# EAGLE design TorquePotSch_SINGLEBOARD (EAGLE 9.2.1)
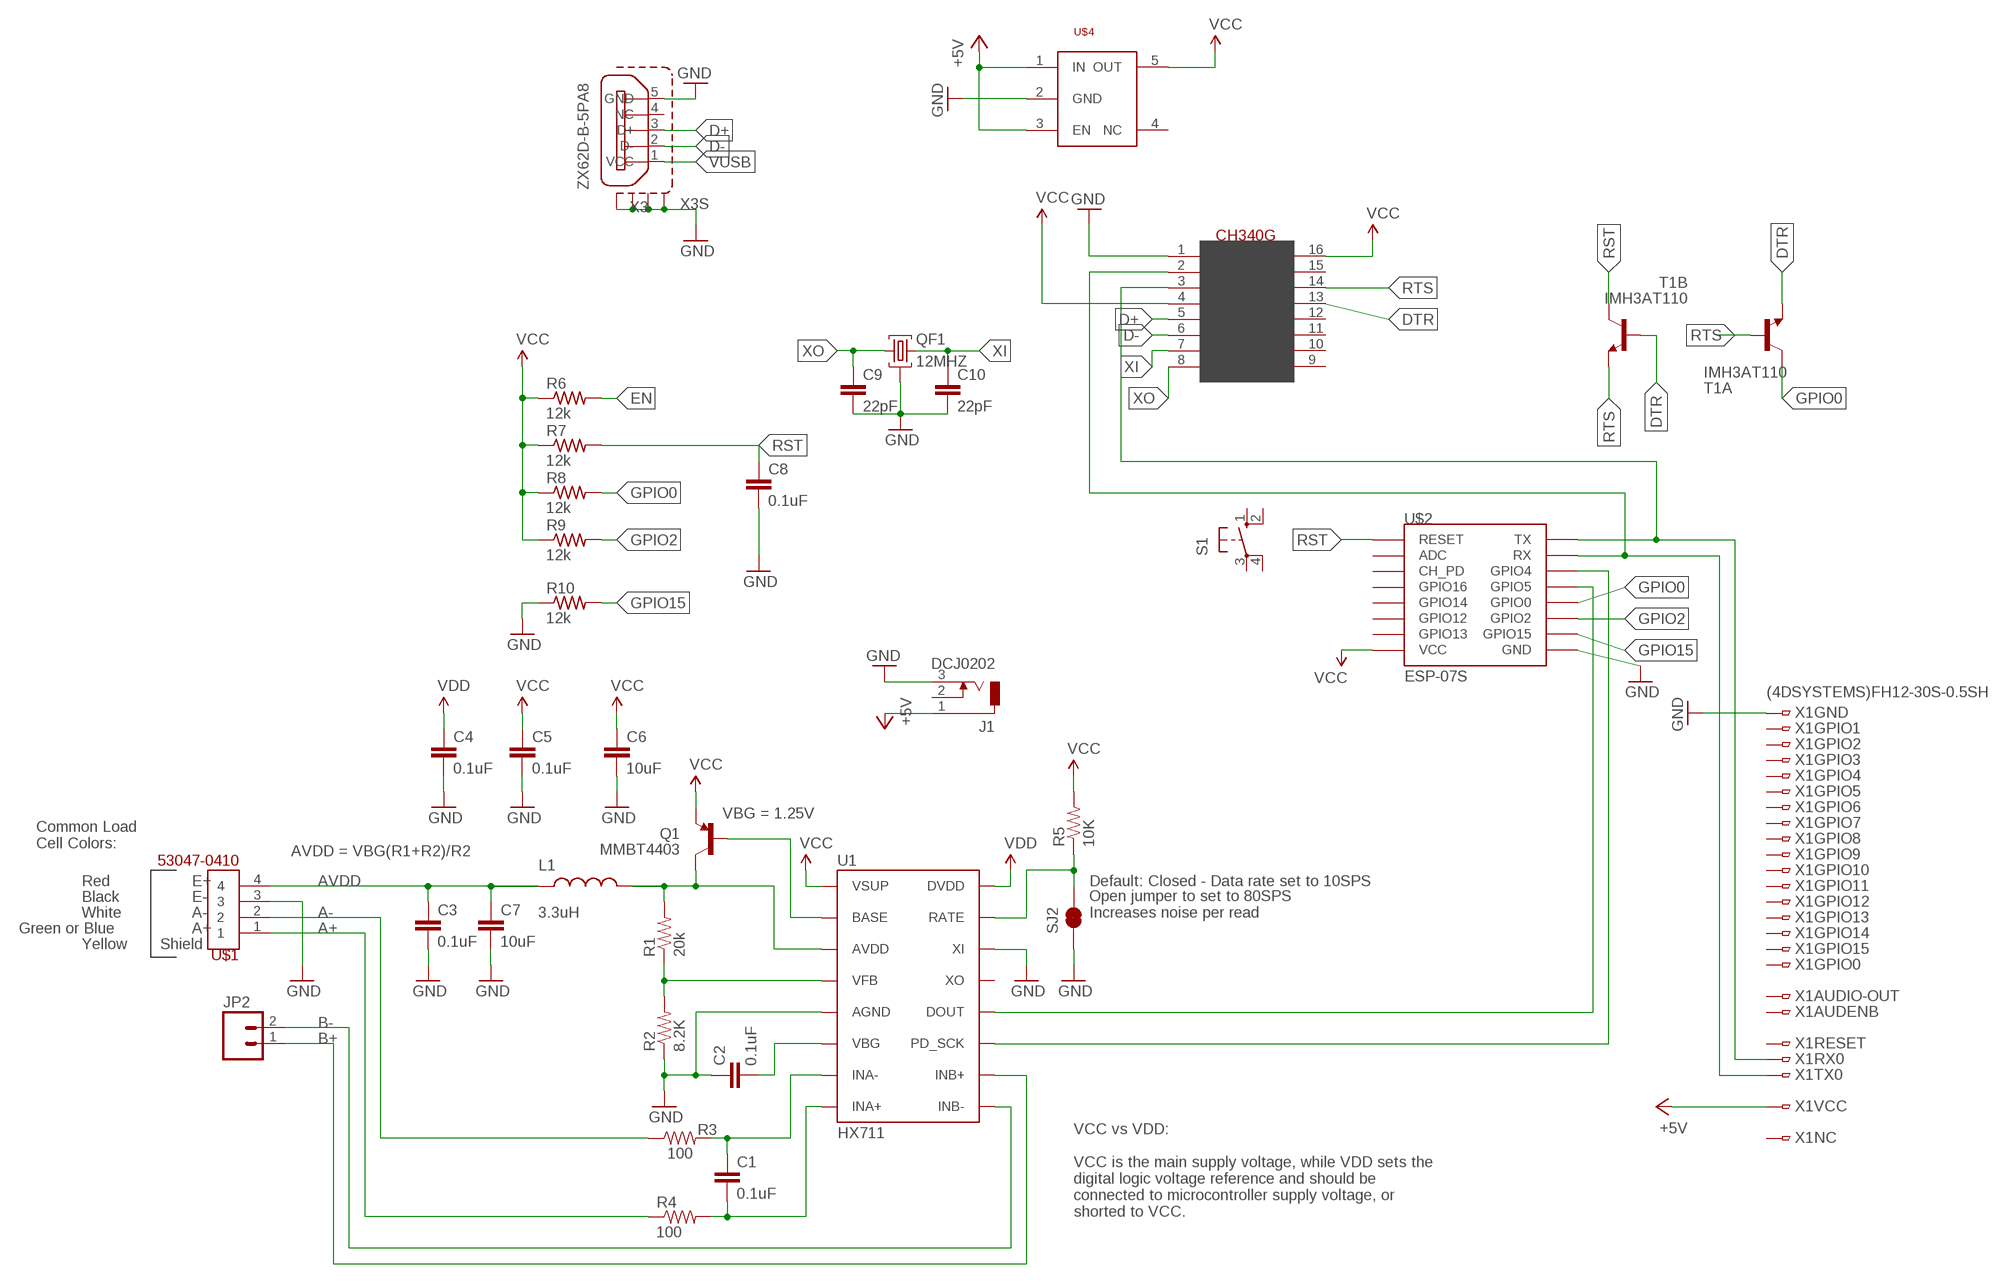
[diagram p0: schematic, sheet 1]

## Parts
C1  0.1uF  0.1UF-25V-5%(0603)  [0603-CAP]
C2  0.1uF  0.1UF-25V-5%(0603)  [0603-CAP]
C3  0.1uF  0.1UF-25V-5%(0603)  [0603-CAP]
C4  0.1uF  0.1UF-25V-5%(0603)  [0603-CAP]
C5  0.1uF  0.1UF-25V-5%(0603)  [0603-CAP]
C6  10uF  10UF50V20%(1210)  [1210]
C7  10uF  10UF50V20%(1210)  [1210]
C8  0.1uF  0.1UF-25V-5%(0603)  [0603-CAP]
C9  22pF  0.1UF-25V-5%(0603)  [0603-CAP]
C10  22pF  0.1UF-25V-5%(0603)  [0603-CAP]
J1  DCJ0202  [DCJ0202]
JP2  M02PTH  [1X02]
L1  3.3uH  INDUCTOR0805-IND  [0805]
Q1  MMBT4403  TRANSISTOR_PNPMMBT4403  [SOT23-3]
QF1  12MHZ  10M7AHC49T  [HC49U]
R1  20k  20KOHM1/10W1%(0603)  [0603-RES]
R2  8.2K  8.2KOHM-1/10W-5%(0603)  [0603-RES]
R3  100  100OHM-1/10W-1%(0603)  [0603-RES]
R4  100  100OHM-1/10W-1%(0603)  [0603-RES]
R5  10K  10KOHM-1/10W-1%(0603)0603  [0603-RES]
R6  12k  R-US_R0805  [R0805]
R7  12k  R-US_R0805  [R0805]
R8  12k  R-US_R0805  [R0805]
R9  12k  R-US_R0805  [R0805]
R10  12k  R-US_R0805  [R0805]
S1  10-XX  [B3F-10XX]
SJ2  JUMPER-PAD-2-NC_BY_TRACE  [PAD-JUMPER-2-NC_BY_TRACE_YES_SILK]
T1  IMH3AT110  [SMT6]
U1  HX711  HX711HX711  [SO16]
U$1  53047-0410  [53047-0410]
U$2  ESP-07S  [ESP07S]
U$3  CH340G  [SOIC16]
U$4  TLV755P  [SOT23-5L]
X1  (4DSYSTEMS)FH12-30S-0.5SH  [FH12-30S-0.5SH]
X3  ZX62D-B-5PA8  [ZX62D-B-5PA8]

## Nets
+5V: J1.1 U$4.1(IN) U$4.3(EN) X1.26 X1.27
A+: R4.1 U$1.1
A-: R3.1 U$1.2
AVDD: C3.1 C7.1 L1.1 U$1.4
B+: JP2.1 U1.10(INB+)
B-: JP2.2 U1.9(INB-)
D+: U$3.5(D+) X3.3(D+)
D-: U$3.6(D-) X3.2(D-)
DTR: T1.6(A:E) U$3.13(DTR)
EN: R6.2
GND: C2.1 C3.2 C4.2 C5.2 C6.2 C7.2 C8.2 C9.2 C10.2 J1.3 QF1.2 R2.1 R10.1 SJ2.1 U1.5(AGND) U1.14(XI) U$1.3 U$2.GND U$3.1(GND) U$4.2(GND) X1.1 X1.21 X1.25 X1.30 X3.5(GND) X3.S1 X3.S2 X3.S3 X3.S4
GPIO0: R8.2 T1.1(A:C) U$2.GPIO0
GPIO2: R9.2 U$2.GPIO2
GPIO15: R10.2 U$2.GPIO15
N$1: R5.1 SJ2.2 U1.15(RATE)
N$2: C1.1 R3.2 U1.7(INA-)
N$3: C1.2 R4.2 U1.8(INA+)
N$4: Q1.1(B) U1.2(BASE)
N$5: L1.2 Q1.3(C) R1.2 U1.3(AVDD)
N$6: R1.1 R2.2 U1.4(VFB)
N$7: C2.2 U1.6(VBG)
N$8: U1.12(DOUT) U$2.GPIO5
N$9: U1.11(PD_SCK) U$2.GPIO4
N$10: U$2.TX U$3.3(RX) X1.23
N$11: U$2.RX U$3.2(TX) X1.24
N$12: T1.4(B:C)
N$13: T1.2(B:B)
N$14: T1.3(B:E)
N$16: T1.5(A:B)
RST: C8.1 R7.2 U$2.REST(RESET)
RTS: U$3.14(RTS)
VCC: C5.1 C6.1 Q1.2(E) R5.2 R6.1 R7.1 R8.1 R9.1 U1.1(VSUP) U$2.VCC U$3.4(V3) U$3.16(VCC) U$4.5(OUT)
VDD: C4.1 U1.16(DVDD)
VUSB: X3.1(VCC)
XI: C10.1 QF1.3 U$3.7(XI)
XO: C9.1 QF1.1 U$3.8(XO)
Unconnected: J1.2 S1.1(S) S1.2(S1) S1.3(P) S1.4(P1) U1.13(XO) U$2.ADC U$2.CH_PD U$2.GPIO12 U$2.GPIO13 U$2.GPIO14 U$2.GPIO16 U$3.9(CTS) U$3.10(DSR) U$3.11(RI) U$3.12(DCD) U$3.15(RS232) U$4.4(NC) X1.2 X1.3 X1.4 X1.5 X1.6 X1.7 X1.8 X1.9 X1.10 X1.11 X1.12 X1.13 X1.14 X1.15 X1.16 X1.17 X1.18 X1.19 X1.20 X1.22 X1.28 X1.29 X3.4(NC)

## Notes on the sheet
- VBG = 1.25V
- Common Load
  Cell Colors:
- AVDD = VBG(R1+R2)/R2
- Red | E+ | Default: Closed - Data rate set to 10SPS
- Black | E-
- White | A-
- Open jumper to set to 80SPS
  Increases noise per read
- Green or Blue | A+
- Yellow | Shield
- VCC vs VDD:
  
  VCC is the main supply voltage, while VDD sets the
  digital logic voltage reference and should be
  connected to microcontroller supply voltage, or
  shorted to VCC.

## Library data of the parts
C1-C5 C8 = SparkFun-Capacitors:0.1UF-25V-5%(0603): CAP-08604; PROD_ID: CAP-08604
C6 C7 = SparkFun-Capacitors:10UF50V20%(1210): CAP-09824; PROD_ID: CAP-09824
C9 C10 = SparkFun-Capacitors:0.1UF-25V-5%(0603): CAP-08604; PROD_ID: CAP-08604; VALUE: 0.1uF
J1 = con-jack:DCJ0202: DC POWER JACK Source: DCJ0202.pdf; OC_FARNELL: unknown; OC_NEWARK: unknown
JP2 = SparkFun-Connectors:M02: Standard 2-pin 0.1" header. Use with - straight break away headers ( PRT-00116) - right angle break away headers (PRT-00553) - swiss pins (PRT-00743) - machine pins (PRT-00117) - female headers (PRT-00115) Molex polarized connector foot print use with: PRT-08233 with associated crimp pins and housings. 2.54_SCREWTERM for use with PRT-10571. 3.5mm Screw Terminal footprints for PRT-08084 5mm Screw Terminal footprints for use with PRT-08432
L1 = SparkFun-Passives:INDUCTOR: Inductors Basic Inductor/Choke - 0603 and 1206. Footprints are not proven and vary greatly between part numbers. INDUCTOR POWER 3.3UH 4.0A SMD 0.197" L x 0.197" W x 0.177" H (5.00mm x 5.00mm x 4.50mm); PROD_ID: NDUC-13076
Q1 = SparkFun-DiscreteSemi:TRANSISTOR_PNP: Generic PNP BJT Double check pinouts against datasheets- not all devices are the same! MMBT3906 - 40V 200mA SOT-23 (TRANS-08052) MMBT4403 - 40V 600mA SOT-23 (TRANS-09245); PROD_ID: TRANS-09245
QF1 = crystal:10M*A: Monolithic Crystal Filters Source: www.vanlong.com; OC_FARNELL: unknown; OC_NEWARK: unknown
R1 = SparkFun-Resistors:20KOHM1/10W1%(0603): RES-09383; PROD_ID: RES-09383
R2 = SparkFun-Resistors:8.2KOHM-1/10W-5%(0603): RES-10646; PROD_ID: RES-10646
R3 R4 = SparkFun-Resistors:100OHM-1/10W-1%(0603): RES-07863; PROD_ID: RES-07863
R5 = SparkFun-Resistors:10KOHM-1/10W-1%(0603): RES-00824; PROD_ID: RES-00824
R6-R10 = adafruit:R-US_: RESISTOR, American symbol
S1 = switch-omron:10-XX: OMRON SWITCH; MPN: B3F-1000; OC_FARNELL: 176432; OC_NEWARK: 36M3542
SJ2 = SparkFun-Passives:JUMPER-PAD-2-NC_BY_TRACE
T1 = personal:IMH3AT110: General purpose transistors (dual digital transistors) Two DTC143T chips in a EMT or UMT or SMT package. http://rohmfs.rohm.com/en/products/databook/datasheet/discrete/transistor/digital/emh3t2r-e.pdf; MPN: IMH3AT110
U1 = Testing:HX711; PROD_ID: IC-12445
U$1 = personal:53047-0410: Molex Picoblade 4 way PCB Header
U$2 = esp8266modules:ESP-07S
U$3 = usb-serial:CH340G
U$4 = personal:TLV755P
X1 = personal:(4DSYSTEMS)FH12-30S-0.5S: 0.5mm Pitch Connectors For FPC/FFC Source: Data sheet <http://www.hirose.co.jp/cataloge_hp/e58605370.pdf> 4d systems data sheet: Data sheet <https://4dsystems.com.au/mwdownloads/download/link/id/70/>; MPN: FH12-30S-0.5SH(55); OC_FARNELL: 1324555; OC_NEWARK: 34M6176
X3 = zx62d-b-5pa8-oshpark_10:ZX62D-B-5PA8: Micro USB Type B Connector - Standard, Shell Through Hole Source: http://www.hirose.co.jp/cataloge_hp/ed_ZX_20140804.pdf; MF: Hirose; MPN: ZX62D-B-5PA8; OC_FARNELL: 2300438; OC_NEWARK: 69W0712

## Board
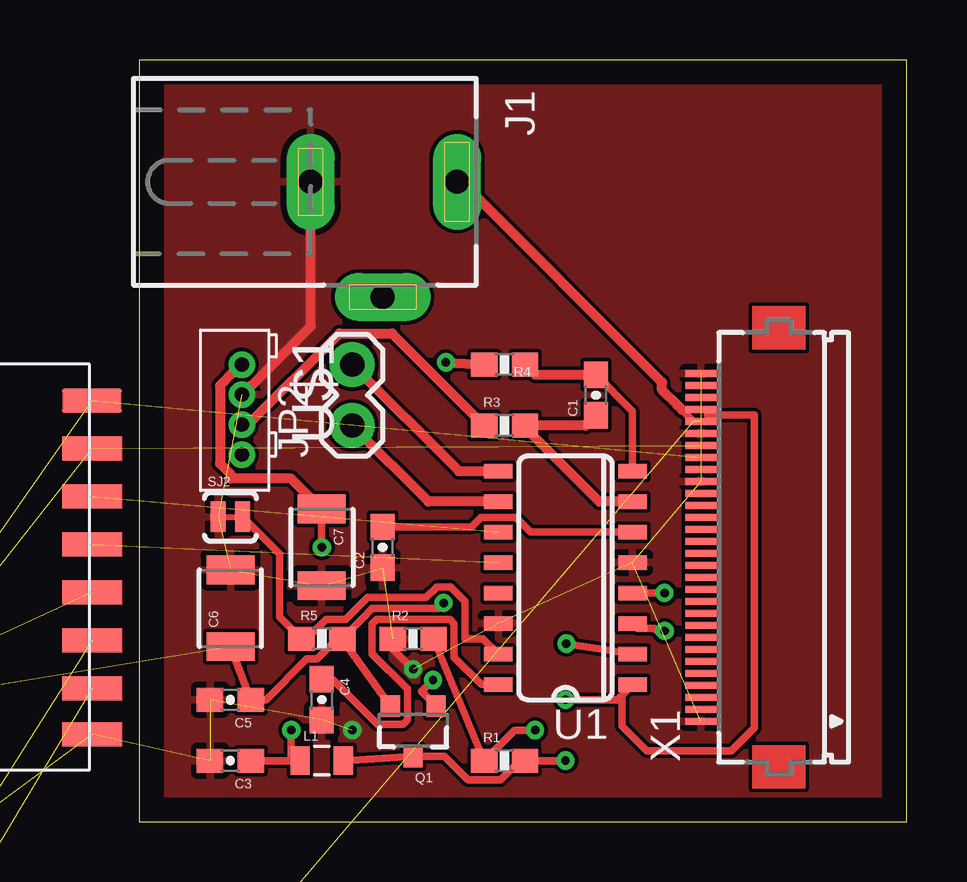
[diagram p1: board, top side]
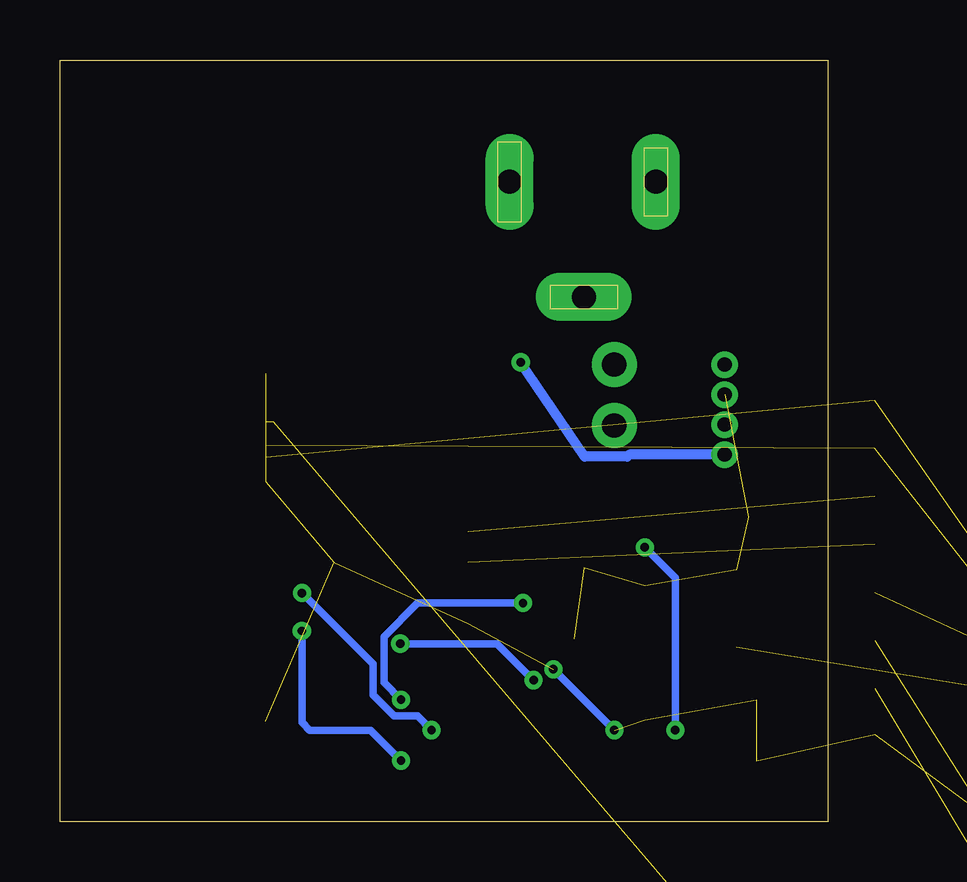
[diagram p2: board, bottom side, seen from below]

Size 32 x 31.75 mm. Coordinates in mm from the lower left corner, seen from the top.
Outline: 0,0 32,0 32,31.75 0,31.75 0,0
Copper layers (1*16): Top 0.035mm / dielectric 1.5mm / Bottom 0.035mm
Design rules "default": minimum track width 6mil, minimum drill 0.35mm, track to track 6mil, track to pad 6mil, pad to pad 6mil, via to via 6mil, smd to smd 6mil, copper to edge 40mil, drill to drill 6mil, minimum pad ring 10mil, minimum via ring 8mil, stop-mask expansion 4mil, vias tented up to drill 0mil, thermal gap 10mil

### Footprints (pad centres in the part's own frame; a part is rotated, then mirrored left to right if it is on the bottom)
0603-CAP = smd 1.1 x 1: 1 -0.85,0; 2 0.85,0
1210 = smd 1.2 x 2: 1 -1.6,0; 2 1.6,0
DCJ0202 = drill 1 pad 2 long: 1 0,3.1; 2 4.8,0; 3 0,-3
1X02 = drill 1.016 pad 1.88: 1 0,0; 2 2.54,0
0805 = smd 0.8 x 1.2: 1 -0.9,0; 2 0.9,0
SOT23-3 = smd 0.8 x 0.9: 1 -0.95,-1; 2 0.95,-1; 3 0,1.1
HC49U = drill 0.7 pad 1.2: 1 -2.413,0; 2 -0.027,0; 3 2.413,0
0603-RES = smd 1.1 x 1: 1 -0.85,0; 2 0.85,0
R0805 = smd 1.1 x 1.4: 1 -1,0; 2 1,0
B3F-10XX = drill 1.016 long: 1 -3.251,2.261; 2 3.251,2.261; 3 -3.251,-2.261; 4 3.251,-2.261
PAD-JUMPER-2-NC_BY_TRACE_YES_SILK = smd 0.635 x 1.27: 1 -0.508,0; 2 0.508,0
SMT6 = smd 0.9 x 0.4: 1 -1.175,0.95; 2 -1.175,0; 3 -1.175,-0.95; 4 1.175,-0.95; 5 1.175,0; 6 1.175,0.95
SO16 = smd 0.6 x 1.2: 1 -4.445,-2.8; 2 -3.175,-2.8; 3 -1.905,-2.8; 4 -0.635,-2.8; 5 0.635,-2.8; 6 1.905,-2.8; 7 3.175,-2.8; 8 4.445,-2.8; 9 4.445,2.8; 10 3.175,2.8; 11 1.905,2.8; 12 0.635,2.8; 13 -0.635,2.8; 14 -1.905,2.8; 15 -3.175,2.8; 16 -4.445,2.8
53047-0410 = drill 0.6 pad 1.016: 1 3.75,0.475; 2 2.5,0.475; 3 1.25,0.475; 4 0,0.475
ESP07S = smd 2.5 x 1: ADC -8.2,3.8; CH_PD -8.2,1.8; GND 8.2,-8.105; GPIO0 8.2,-2.2; GPIO2 8.2,-4.2; GPIO4 8.2,1.8; GPIO5 8.2,-0.2; GPIO12 -8.2,-4.2; GPIO13 -8.2,-6.2; GPIO14 -8.2,-2.2; GPIO15 8.2,-6.2; GPIO16 -8.2,-0.2; REST -8.2,5.8; RX 8.2,3.8; TX 8.2,5.8; VCC -8.2,-8.105
SOIC16 = smd 0.635 x 1.524: 1 -4.445,-2.695; 2 -3.175,-2.695; 3 -1.905,-2.695; 4 -0.635,-2.695; 5 0.635,-2.695; 6 1.905,-2.695; 7 3.175,-2.695; 8 4.445,-2.695; 9 4.445,2.695; 10 3.175,2.695; 11 1.905,2.695; 12 0.635,2.695; 13 -0.635,2.695; 14 -1.905,2.695; 15 -3.175,2.695; 16 -4.445,2.695
SOT23-5L = smd 0.9 x 0.4: 1 -1.175,0.95; 2 -1.175,0; 3 -1.175,-0.95; 4 1.175,-0.95; 5 1.175,0.95
FH12-30S-0.5SH = smd 0.3 x 1.3: 1 -7.25,3.25; 2 -6.75,3.25; 3 -6.25,3.25; 4 -5.75,3.25; 5 -5.25,3.25; 6 -4.75,3.25; 7 -4.25,3.25; 8 -3.75,3.25; 9 -3.25,3.25; 10 -2.75,3.25; 11 -2.25,3.25; 12 -1.75,3.25; 13 -1.25,3.25; 14 -0.75,3.25; 15 -0.25,3.25; 16 0.25,3.25; 17 0.75,3.25; 18 1.25,3.25; 19 1.75,3.25; 20 2.25,3.25; 21 2.75,3.25; 22 3.25,3.25; 23 3.75,3.25; 24 4.25,3.25; 25 4.75,3.25; 26 5.25,3.25; 27 5.75,3.25; 28 6.25,3.25; 29 6.75,3.25; 30 7.25,3.25
ZX62D-B-5PA8 = smd 1.35 x 0.4: 1 4.825,1.3; 2 4.825,0.65; 3 4.825,0; 4 4.825,-0.65; 5 4.825,-1.3 | drill 1.5: S1 2.15,-3.6; S2 2.15,3.6 | drill 0.7 long: S3 5.05,2.425; S4 5.05,-2.425

### Placement (x,y rotation side)
C1  19.05,17.78 90 top
C2  10.16,11.43 90 top
C3  3.81,2.54 180 top
C4  7.62,5.08 270 top
C5  3.81,5.08 180 top
C6  3.81,8.89 90 top
C7  7.62,11.43 270 top
C8  -28.26,-40.01 0 top  (outside the outline)
C9  -28.26,-59.69 0 top  (outside the outline)
C10  -28.26,-62.87 0 top  (outside the outline)
J1  10.16,26.67 270 top
JP2  8.89,16.51 90 top
L1  7.62,2.54 0 top
Q1  11.43,3.81 180 top
QF1  -24.13,-53.34 0 top  (outside the outline)
R1  15.24,2.54 0 top
R2  11.43,7.62 0 top
R3  15.24,16.51 0 top
R4  15.24,19.05 0 top
R5  7.62,7.62 0 top
R6  -27.62,-19.05 0 top  (outside the outline)
R7  -27.62,-23.18 0 top  (outside the outline)
R8  -27.62,-27.3 0 top  (outside the outline)
R9  -27.62,-31.43 0 top  (outside the outline)
R10  -27.62,-35.56 0 top  (outside the outline)
S1  -24.77,5.71 0 top  (outside the outline)
SJ2  3.81,12.7 0 top
T1  -27.62,-3.81 0 top  (outside the outline)
U1  17.78,10.16 90 top
U$1  3.81,19.05 270 top
U$2  -10.16,11.75 0 top
U$3  -22.86,-12.38 0 top  (outside the outline)
U$4  -27.62,-45.09 0 top  (outside the outline)
X1  26.67,11.43 90 top
X3  -48.58,-57.47 0 top  (outside the outline)

### Tracks (layer width: path | path; a pad name or v marks a point on that pad's centre or on a via)
+5V  (4 unrouted)
  Top 0.305: X1.27 22.62,17.17 | 22.44,17.36 23.12,16.68
  Top 0.406: 22.62,17.17 22.44,17.36 21.8,17.99 21.8,18.31 13.45,26.67 J1.1
A+  (via drill 0.35)
  Top 0.406: v12.79,19.14 R4.1
  Bottom 0.406: U$1.1 8.27,15.3 8.35,15.21 10.13,15.21 v12.79,19.14
A-
  Top 0.406: U$1.2 4.56,16.55 8.35,20.34 10.55,20.34 R3.1
AVDD  (via drill 0.35)
  Top 0.305: L1.1 6.35,2.54 | 6.35,2.54 C3.1 | C7.1 v7.62,11.43 | v6.35,3.81 6.35,2.54
  Top 0.406: U$1.4 3.94,18.71 3.91,18.71 3.38,18.18 3.38,14.92 3.81,14.49 3.81,14.3 6.35,14.3 C7.1
  Bottom 0.305: v7.62,11.43 6.35,10.16 v6.35,3.81
B+
  Top 0.406: U1.10 12.06,13.34 JP2.1
B-
  Top 0.406: JP2.2 13.34,14.61 U1.9
D+  (1 unrouted)
D-  (1 unrouted)
DTR  (1 unrouted)
GND  (via drill 0.35)  (27 unrouted)
  Top 0.305: R2.1 10.58,7.2 v11.43,6.35
  Top 0.406: U$1.3 4.62,18.14 4.66,18.14 7.16,20.64 J1.3
  Bottom 0.305: v11.43,6.35 v8.89,3.81
  pour Top: 0,0 0,31.75 32,31.75 32,0
GPIO0  (2 unrouted)
GPIO2  (1 unrouted)
GPIO15  (1 unrouted)
N$1
  Top 0.305: SJ2.2 5.87,11.15 5.87,8.52 R5.1 6.99,7.62 7.79,8.43 8.61,8.43 9.53,9.34 11.96,9.34 12.42,9.79 12.98,9.79 13.59,9.18 13.59,7.62 14.35,7.62 U1.15
N$2
  Top 0.406: U1.7 19.18,13.34 16.09,16.42 R3.2 18.63,16.51 C1.1
N$3
  Top 0.305: C1.2 20.58,17.1 U1.8
  Top 0.406: R4.2 16.51,18.63 C1.2
N$4  (via drill 0.35)
  Top 0.305: Q1.1 11.77,5.42 12.24,5.89 v12.26,5.89 | v17.81,7.41 U1.2
  Bottom 0.305: v12.26,5.89 13.78,7.41 v17.81,7.41
N$5  (via drill 0.35)
  Top 0.305: L1.2 Q1.3 12.74,2.71 13.71,1.74 15.07,1.74 15.87,2.54 R1.2 v17.78,2.54 | v21.92,7.95 21.6,7.95 21.5,8.05 20.79,8.05 U1.3
  Bottom 0.305: v17.78,2.54 19.05,3.81 21.59,3.81 21.92,4.14 v21.92,7.95
N$6  (via drill 0.35)
  Top 0.305: R2.2 R1.1 15.66,3.81 v16.51,3.81 | v21.91,9.53 U1.4
  Bottom 0.305: v21.91,9.53 18.95,6.57 18.95,5.29 18.06,4.4 17.1,4.4 v16.51,3.81
N$7
  Top 0.305: C2.2 13.86,12.28 14.25,12.67 15.71,12.67 16.31,12.06 U1.6
N$8  (1 unrouted)
N$9  (1 unrouted)
N$10  (2 unrouted)
N$11  (2 unrouted)
RST  (2 unrouted)
VCC  (via drill 0.35)  (8 unrouted)
  Top 0.305: Q1.2 R5.2 | R5.2 8.25,7.62 7.42,6.79 6.99,6.79 5.29,5.08 C5.1 C6.1 | v12.7,9.11 12.47,8.88 9.71,8.88 9.27,8.44 9.27,8.42 R5.2 | v17.78,5.08 19.95,5.08 20.13,5.27 | 20.13,5.27 U1.1 | 20.13,5.27 20.13,4 21.18,2.95 24.69,2.95 25.64,3.9 25.64,16.95 23.69,16.95
  Bottom 0.305: v17.78,5.08 18.5,5.8 18.5,7.7 17.09,9.11 v12.7,9.11
VDD
  Top 0.305: U1.16 14.27,5.71 13.13,6.85 13.13,8.25 12.96,8.43 9.9,8.43 9.72,8.25 9.72,6.99 11.19,5.53 11.19,4.23 11.01,4.05 9.95,4.05 8.08,5.93 C4.1
XI  (2 unrouted)
XO  (2 unrouted)